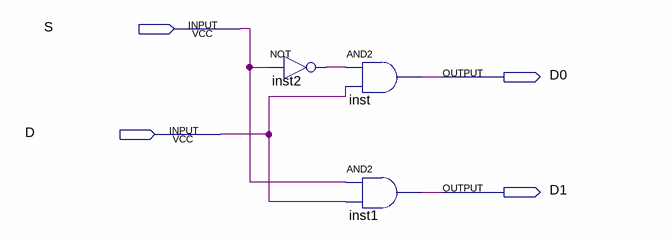
[diagram p0: schematic sheet]
// Quartus schematic demux12.bdf as structural Verilog: 3 symbols, 4 pins
module demux12 (
  input  S,
  input  D,
  output D0,
  output D1
);

  wire inst2_out;

  not inst2 (inst2_out, S);
  and inst (D0, inst2_out, D);
  and inst1 (D1, S, D);
endmodule
